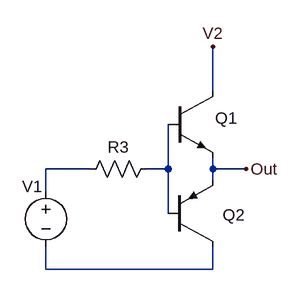
[diagram p0: schematic push_pull.asc]
push_pull.asc, the LTspice schematic file:
Version 4
SHEET 1 880 680
WIRE 272 96 272 32
WIRE 96 208 32 208
WIRE 208 208 208 144
WIRE 208 208 176 208
WIRE 272 208 272 192
WIRE 320 208 272 208
WIRE 272 224 272 208
WIRE 32 240 32 208
WIRE 208 272 208 208
WIRE 32 352 32 320
WIRE 272 352 272 320
WIRE 272 352 32 352
FLAG 272 32 V2
FLAG 320 208 Out
SYMBOL voltage 32 224 R0
WINDOW 0 -34 9 Left 2
SYMATTR InstName V1
SYMATTR Value ""
SYMBOL pnp 208 320 M180
WINDOW 0 78 46 Left 2
SYMATTR InstName Q2
SYMATTR Value ""
SYMBOL npn 208 96 R0
WINDOW 0 67 39 Left 2
SYMATTR InstName Q1
SYMATTR Value ""
SYMBOL res 192 192 R90
WINDOW 0 0 56 VBottom 2
WINDOW 3 32 56 VTop 2
SYMATTR InstName R3
SYMATTR Value ""

The netlist it stands for:
* push_pull.asc
V1 N001 N003
Q2 N003 N002 Out 0
Q1 V2 N002 Out 0
R3 N002 N001
.model NPN NPN
.model PNP PNP
.lib standard.bjt
.backanno
.end